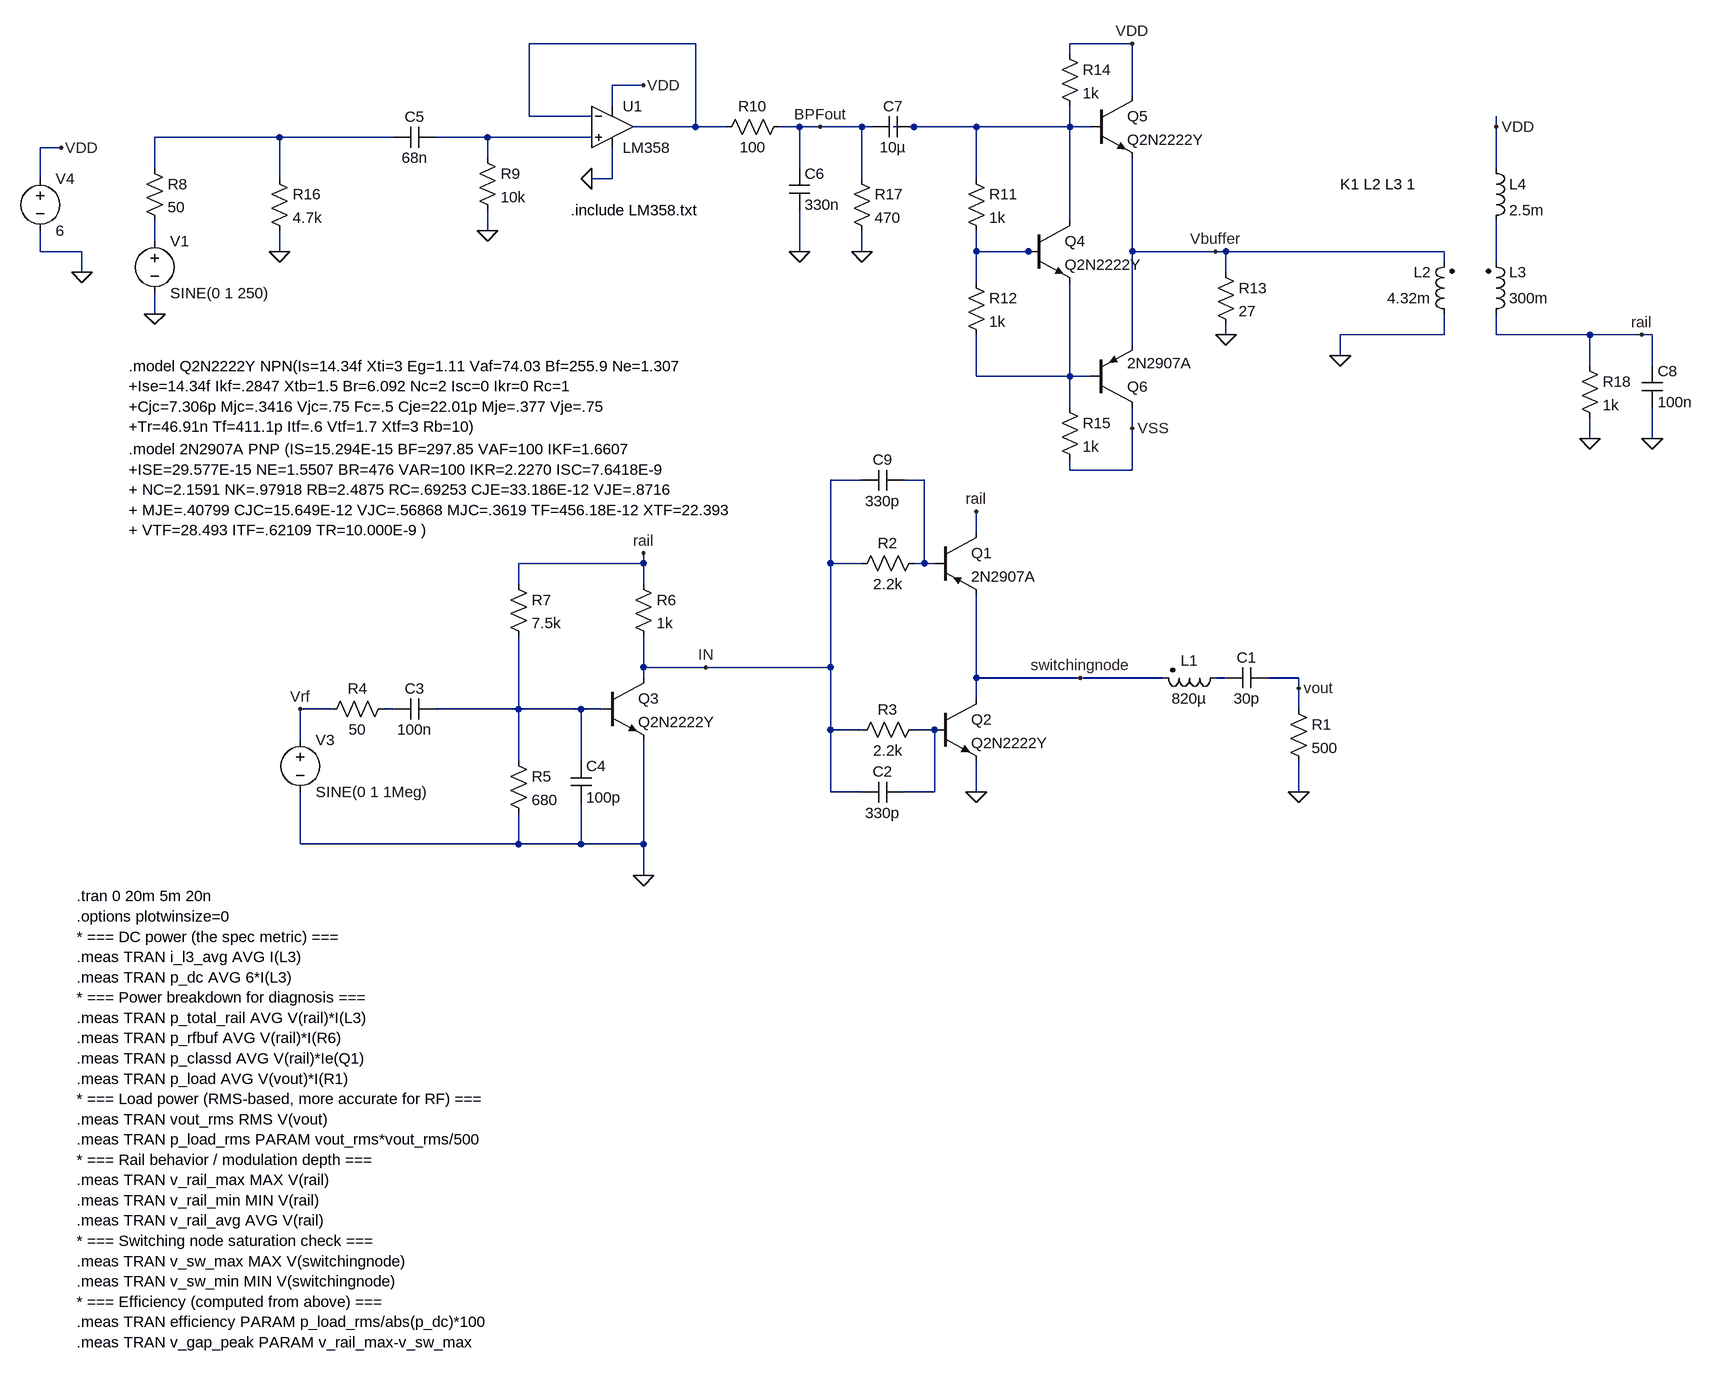
[diagram p0: schematic am_transmitter.asc]
am_transmitter.asc, the LTspice schematic file:
Version 4
SHEET 1 2644 2208
WIRE -1488 64 -1744 64
WIRE -816 64 -912 64
WIRE -912 80 -912 64
WIRE -1568 128 -1616 128
WIRE -816 144 -816 64
WIRE -1616 160 -1616 128
WIRE -1744 176 -1744 64
WIRE -1648 176 -1744 176
WIRE -1488 192 -1488 64
WIRE -1488 192 -1584 192
WIRE -1440 192 -1488 192
WIRE -1328 192 -1360 192
WIRE -1296 192 -1328 192
WIRE -1232 192 -1296 192
WIRE -1216 192 -1232 192
WIRE -1152 192 -1184 192
WIRE -1056 192 -1152 192
WIRE -912 192 -912 160
WIRE -912 192 -1056 192
WIRE -880 192 -912 192
WIRE -256 192 -256 176
WIRE -2128 208 -2320 208
WIRE -1952 208 -2128 208
WIRE -1808 208 -1888 208
WIRE -1648 208 -1808 208
WIRE -2464 224 -2496 224
WIRE -1808 240 -1808 208
WIRE -2320 256 -2320 208
WIRE -1328 256 -1328 192
WIRE -256 256 -256 192
WIRE -2496 272 -2496 224
WIRE -2128 272 -2128 208
WIRE -1616 272 -1616 224
WIRE -1616 272 -1648 272
WIRE -1232 272 -1232 192
WIRE -1056 272 -1056 192
WIRE -912 336 -912 192
WIRE -1808 352 -1808 320
WIRE -2320 368 -2320 336
WIRE -2496 384 -2496 352
WIRE -2432 384 -2496 384
WIRE -2128 384 -2128 352
WIRE -1328 384 -1328 320
WIRE -1232 384 -1232 352
WIRE -1056 384 -1056 352
WIRE -976 384 -1056 384
WIRE -960 384 -976 384
WIRE -816 384 -816 240
WIRE -688 384 -816 384
WIRE -672 384 -688 384
WIRE -336 384 -672 384
WIRE -336 400 -336 384
WIRE -256 400 -256 336
WIRE -2432 416 -2432 384
WIRE -672 416 -672 384
WIRE -1056 432 -1056 384
WIRE -2320 480 -2320 448
WIRE -672 512 -672 496
WIRE -336 512 -336 480
WIRE -336 512 -496 512
WIRE -256 512 -256 480
WIRE -112 512 -256 512
WIRE -32 512 -112 512
WIRE -16 512 -32 512
WIRE -816 528 -816 384
WIRE -496 544 -496 512
WIRE -112 560 -112 512
WIRE -16 560 -16 512
WIRE -1056 576 -1056 512
WIRE -912 576 -912 432
WIRE -912 576 -1056 576
WIRE -880 576 -912 576
WIRE -912 624 -912 576
WIRE -816 656 -816 624
WIRE -112 672 -112 640
WIRE -16 672 -16 624
WIRE -912 720 -912 704
WIRE -816 720 -816 656
WIRE -816 720 -912 720
WIRE -1232 736 -1280 736
WIRE -1136 736 -1168 736
WIRE -1056 816 -1056 784
WIRE -1568 864 -1568 848
WIRE -1568 864 -1760 864
WIRE -1280 864 -1280 736
WIRE -1232 864 -1280 864
WIRE -1136 864 -1136 736
WIRE -1136 864 -1152 864
WIRE -1120 864 -1136 864
WIRE -1760 896 -1760 864
WIRE -1568 896 -1568 864
WIRE -1568 1024 -1568 976
WIRE -1472 1024 -1568 1024
WIRE -1280 1024 -1280 864
WIRE -1280 1024 -1472 1024
WIRE -1568 1040 -1568 1024
WIRE -1056 1040 -1056 912
WIRE -896 1040 -1056 1040
WIRE -768 1040 -896 1040
WIRE -672 1040 -688 1040
WIRE -560 1040 -608 1040
WIRE -560 1056 -560 1040
WIRE -1056 1072 -1056 1040
WIRE -2048 1088 -2096 1088
WIRE -1952 1088 -1968 1088
WIRE -1760 1088 -1760 976
WIRE -1760 1088 -1888 1088
WIRE -1664 1088 -1760 1088
WIRE -1632 1088 -1664 1088
WIRE -560 1088 -560 1056
WIRE -1280 1120 -1280 1024
WIRE -1232 1120 -1280 1120
WIRE -1120 1120 -1152 1120
WIRE -2096 1136 -2096 1088
WIRE -1760 1168 -1760 1088
WIRE -1664 1168 -1664 1088
WIRE -1280 1216 -1280 1120
WIRE -1232 1216 -1280 1216
WIRE -1120 1216 -1120 1120
WIRE -1120 1216 -1168 1216
WIRE -1056 1216 -1056 1168
WIRE -560 1216 -560 1168
WIRE -2096 1296 -2096 1216
WIRE -1760 1296 -1760 1248
WIRE -1760 1296 -2096 1296
WIRE -1664 1296 -1664 1232
WIRE -1664 1296 -1760 1296
WIRE -1568 1296 -1568 1136
WIRE -1568 1296 -1664 1296
WIRE -1568 1344 -1568 1296
FLAG -1056 1216 0
FLAG -1472 1024 IN
FLAG -560 1216 0
FLAG -560 1056 vout
FLAG -896 1040 switchingnode
FLAG -1568 1344 0
FLAG -1568 848 rail
FLAG -2432 416 0
FLAG -2464 224 VDD
FLAG -1056 784 rail
FLAG -2320 480 0
FLAG -1568 128 VDD
FLAG -1648 272 0
FLAG -1808 352 0
FLAG -1328 384 0
FLAG -816 64 VDD
FLAG -816 656 VSS
FLAG -672 512 0
FLAG -1296 192 BPFout
FLAG -688 384 Vbuffer
FLAG -2128 384 0
FLAG -496 544 0
FLAG -112 672 0
FLAG -256 192 VDD
FLAG -16 672 0
FLAG -32 512 rail
FLAG -2096 1088 Vrf
FLAG -1232 384 0
SYMBOL res -576 1072 R0
SYMATTR InstName R1
SYMATTR Value 500
SYMBOL pnp -1120 816 R0
SYMATTR InstName Q1
SYMATTR Value 2N2907A
SYMBOL npn -1120 1072 R0
SYMATTR InstName Q2
SYMATTR Value Q2N2222Y
SYMBOL res -1136 848 R90
WINDOW 0 0 56 VBottom 2
WINDOW 3 32 56 VTop 2
SYMATTR InstName R2
SYMATTR Value 2.2k
SYMBOL res -1248 1136 R270
WINDOW 0 32 56 VTop 2
WINDOW 3 0 56 VBottom 2
SYMATTR InstName R3
SYMATTR Value 2.2k
SYMBOL ind2 -672 1024 R90
WINDOW 0 5 56 VBottom 2
WINDOW 3 32 56 VTop 2
SYMATTR InstName L1
SYMATTR Value 820µ
SYMATTR Type ind
SYMBOL cap -608 1024 R90
WINDOW 0 0 32 VBottom 2
WINDOW 3 32 32 VTop 2
SYMATTR InstName C1
SYMATTR Value 30p
SYMBOL cap -1168 1200 R90
WINDOW 0 0 32 VBottom 2
WINDOW 3 32 32 VTop 2
SYMATTR InstName C2
SYMATTR Value 330p
SYMBOL npn -1632 1040 R0
SYMATTR InstName Q3
SYMATTR Value Q2N2222Y
SYMBOL voltage -2096 1120 R0
SYMATTR InstName V3
SYMATTR Value SINE(0 1 1Meg)
SYMATTR Value2 AC 1
SYMBOL res -1952 1072 R90
WINDOW 0 0 56 VBottom 2
WINDOW 3 32 56 VTop 2
SYMATTR InstName R4
SYMATTR Value 50
SYMBOL res -1776 1152 R0
SYMATTR InstName R5
SYMATTR Value 680
SYMBOL res -1584 880 R0
SYMATTR InstName R6
SYMATTR Value 1k
SYMBOL cap -1888 1072 R90
WINDOW 0 0 32 VBottom 2
WINDOW 3 32 32 VTop 2
SYMATTR InstName C3
SYMATTR Value 100n
SYMBOL res -1776 880 R0
SYMATTR InstName R7
SYMATTR Value 7.5k
SYMBOL cap -1680 1168 R0
SYMATTR InstName C4
SYMATTR Value 100p
SYMBOL voltage -2496 256 R0
SYMATTR InstName V4
SYMATTR Value 6
SYMBOL OpAmps/opamp2 -1616 128 R0
SYMATTR InstName U1
SYMATTR Value LM358
SYMBOL voltage -2320 352 R0
SYMATTR InstName V1
SYMATTR Value SINE(0 1 250)
SYMATTR Value2 AC 1
SYMBOL res -2336 240 R0
SYMATTR InstName R8
SYMATTR Value 50
SYMBOL cap -1888 192 R90
WINDOW 0 0 32 VBottom 2
WINDOW 3 32 32 VTop 2
SYMATTR InstName C5
SYMATTR Value 68n
SYMBOL res -1824 224 R0
SYMATTR InstName R9
SYMATTR Value 10k
SYMBOL res -1344 176 R90
WINDOW 0 0 56 VBottom 2
WINDOW 3 32 56 VTop 2
SYMATTR InstName R10
SYMATTR Value 100
SYMBOL cap -1344 256 R0
SYMATTR InstName C6
SYMATTR Value 330n
SYMBOL npn -976 336 R0
SYMATTR InstName Q4
SYMATTR Value Q2N2222Y
SYMBOL npn -880 144 R0
SYMATTR InstName Q5
SYMATTR Value Q2N2222Y
SYMBOL res -1072 256 R0
SYMATTR InstName R11
SYMATTR Value 1k
SYMBOL res -1072 416 R0
SYMATTR InstName R12
SYMATTR Value 1k
SYMBOL res -688 400 R0
SYMATTR InstName R13
SYMATTR Value 27
SYMBOL res -928 64 R0
SYMATTR InstName R14
SYMATTR Value 1k
SYMBOL res -928 608 R0
SYMATTR InstName R15
SYMATTR Value 1k
SYMBOL cap -1152 176 R90
WINDOW 0 0 32 VBottom 2
WINDOW 3 32 32 VTop 2
SYMATTR InstName C7
SYMATTR Value 10µ
SYMBOL pnp -880 624 M180
SYMATTR InstName Q6
SYMATTR Value 2N2907A
SYMBOL res -2144 256 R0
SYMATTR InstName R16
SYMATTR Value 4.7k
SYMBOL ind2 -320 496 R180
WINDOW 0 36 80 Left 2
WINDOW 3 36 40 Left 2
SYMATTR InstName L2
SYMATTR Value 4.32m
SYMATTR SpiceLine Rser=1.1
SYMBOL ind2 -272 496 M180
WINDOW 0 36 80 Left 2
WINDOW 3 36 40 Left 2
SYMATTR InstName L3
SYMATTR Value 300m
SYMATTR SpiceLine Rser=35
SYMBOL res -128 544 R0
SYMATTR InstName R18
SYMATTR Value 1k
SYMBOL ind -272 240 R0
SYMATTR InstName L4
SYMATTR Value 2.5m
SYMBOL cap -32 560 R0
SYMATTR InstName C8
SYMATTR Value 100n
SYMBOL cap -1168 720 R90
WINDOW 0 0 32 VBottom 2
WINDOW 3 32 32 VTop 2
SYMATTR InstName C9
SYMATTR Value 330p
SYMBOL res -1248 256 R0
SYMATTR InstName R17
SYMATTR Value 470
TEXT -2360 560 Left 2 !.model Q2N2222Y NPN(Is=14.34f Xti=3 Eg=1.11 Vaf=74.03 Bf=255.9 Ne=1.307\n+Ise=14.34f Ikf=.2847 Xtb=1.5 Br=6.092 Nc=2 Isc=0 Ikr=0 Rc=1\n+Cjc=7.306p Mjc=.3416 Vjc=.75 Fc=.5 Cje=22.01p Mje=.377 Vje=.75\n+Tr=46.91n Tf=411.1p Itf=.6 Vtf=1.7 Xtf=3 Rb=10)
TEXT -2360 688 Left 2 !.model 2N2907A PNP (IS=15.294E-15 BF=297.85 VAF=100 IKF=1.6607\n+ISE=29.577E-15 NE=1.5507 BR=476 VAR=100 IKR=2.2270 ISC=7.6418E-9\n+ NC=2.1591 NK=.97918 RB=2.4875 RC=.69253 CJE=33.186E-12 VJE=.8716\n+ MJE=.40799 CJC=15.649E-12 VJC=.56868 MJC=.3619 TF=456.18E-12 XTF=22.393\n+ VTF=28.493 ITF=.62109 TR=10.000E-9 )
TEXT -2440 1376 Left 2 !.tran 0 20m 5m 20n\n.options plotwinsize=0\n* === DC power (the spec metric) ===\n.meas TRAN i_l3_avg AVG I(L3)\n.meas TRAN p_dc AVG 6*I(L3)\n* === Power breakdown for diagnosis ===\n.meas TRAN p_total_rail AVG V(rail)*I(L3)\n.meas TRAN p_rfbuf AVG V(rail)*I(R6)\n.meas TRAN p_classd AVG V(rail)*Ie(Q1)\n.meas TRAN p_load AVG V(vout)*I(R1)\n* === Load power (RMS-based, more accurate for RF) ===\n.meas TRAN vout_rms RMS V(vout)\n.meas TRAN p_load_rms PARAM vout_rms*vout_rms/500\n* === Rail behavior / modulation depth ===\n.meas TRAN v_rail_max MAX V(rail)\n.meas TRAN v_rail_min MIN V(rail)\n.meas TRAN v_rail_avg AVG V(rail)\n* === Switching node saturation check ===\n.meas TRAN v_sw_max MAX V(switchingnode)\n.meas TRAN v_sw_min MIN V(switchingnode)\n* === Efficiency (computed from above) ===\n.meas TRAN efficiency PARAM p_load_rms/abs(p_dc)*100\n.meas TRAN v_gap_peak PARAM v_rail_max-v_sw_max
TEXT -1680 320 Left 2 !.include LM358.txt
TEXT -496 280 Left 2 !K1 L2 L3 1

The netlist it stands for:
* am_transmitter.asc
R1 vout 0 500
Q1 rail N009 switchingnode 0 2N2907A
Q2 switchingnode N013 0 0 Q2N2222Y
R2 N009 IN 2.2k
R3 IN N013 2.2k
L1 N010 switchingnode 820µ
C1 vout N010 30p
C2 N013 IN 330p
Q3 IN N012 0 0 Q2N2222Y
V3 Vrf 0 SINE(0 1 1Meg) AC 1
R4 N011 Vrf 50
R5 N012 0 680
R6 rail IN 1k
C3 N012 N011 100n
R7 rail N012 7.5k
C4 N012 0 100p
V4 VDD 0 6
XU1 N004 N001 VDD 0 N001 LM358  ; pins In+ In- V+ V- OUT
V1 N005 0 SINE(0 1 250) AC 1
R8 N003 N005 50
C5 N004 N003 68n
R9 N004 0 10k
R10 BPFout N001 100
C6 BPFout 0 330n
Q4 N002 N006 N008 0 Q2N2222Y
Q5 VDD N002 Vbuffer 0 Q2N2222Y
R11 N002 N006 1k
R12 N006 N008 1k
R13 Vbuffer 0 27
R14 VDD N002 1k
R15 N008 VSS 1k
C7 N002 BPFout 10µ
Q6 VSS N008 Vbuffer 0 2N2907A
R16 N003 0 4.7k
L2 0 Vbuffer 4.32m Rser=1.1
L3 rail N007 300m Rser=35
R18 rail 0 1k
L4 VDD N007 2.5m
C8 rail 0 100n
C9 N009 IN 330p
R17 BPFout 0 470
.model NPN NPN
.model PNP PNP
.lib standard.bjt
.model Q2N2222Y NPN(Is=14.34f Xti=3 Eg=1.11 Vaf=74.03 Bf=255.9 Ne=1.307
+Ise=14.34f Ikf=.2847 Xtb=1.5 Br=6.092 Nc=2 Isc=0 Ikr=0 Rc=1
+Cjc=7.306p Mjc=.3416 Vjc=.75 Fc=.5 Cje=22.01p Mje=.377 Vje=.75
+Tr=46.91n Tf=411.1p Itf=.6 Vtf=1.7 Xtf=3 Rb=10)
.model 2N2907A PNP (IS=15.294E-15 BF=297.85 VAF=100 IKF=1.6607
+ISE=29.577E-15 NE=1.5507 BR=476 VAR=100 IKR=2.2270 ISC=7.6418E-9
+ NC=2.1591 NK=.97918 RB=2.4875 RC=.69253 CJE=33.186E-12 VJE=.8716
+ MJE=.40799 CJC=15.649E-12 VJC=.56868 MJC=.3619 TF=456.18E-12 XTF=22.393
+ VTF=28.493 ITF=.62109 TR=10.000E-9 )
.tran 0 20m 5m 20n
.options plotwinsize=0
* === DC power (the spec metric) ===
.meas TRAN i_l3_avg AVG I(L3)
.meas TRAN p_dc AVG 6*I(L3)
* === Power breakdown for diagnosis ===
.meas TRAN p_total_rail AVG V(rail)*I(L3)
.meas TRAN p_rfbuf AVG V(rail)*I(R6)
.meas TRAN p_classd AVG V(rail)*Ie(Q1)
.meas TRAN p_load AVG V(vout)*I(R1)
* === Load power (RMS-based, more accurate for RF) ===
.meas TRAN vout_rms RMS V(vout)
.meas TRAN p_load_rms PARAM vout_rms*vout_rms/500
* === Rail behavior / modulation depth ===
.meas TRAN v_rail_max MAX V(rail)
.meas TRAN v_rail_min MIN V(rail)
.meas TRAN v_rail_avg AVG V(rail)
* === Switching node saturation check ===
.meas TRAN v_sw_max MAX V(switchingnode)
.meas TRAN v_sw_min MIN V(switchingnode)
* === Efficiency (computed from above) ===
.meas TRAN efficiency PARAM p_load_rms/abs(p_dc)*100
.meas TRAN v_gap_peak PARAM v_rail_max-v_sw_max
.include LM358.txt
K1 L2 L3 1
.backanno
.end